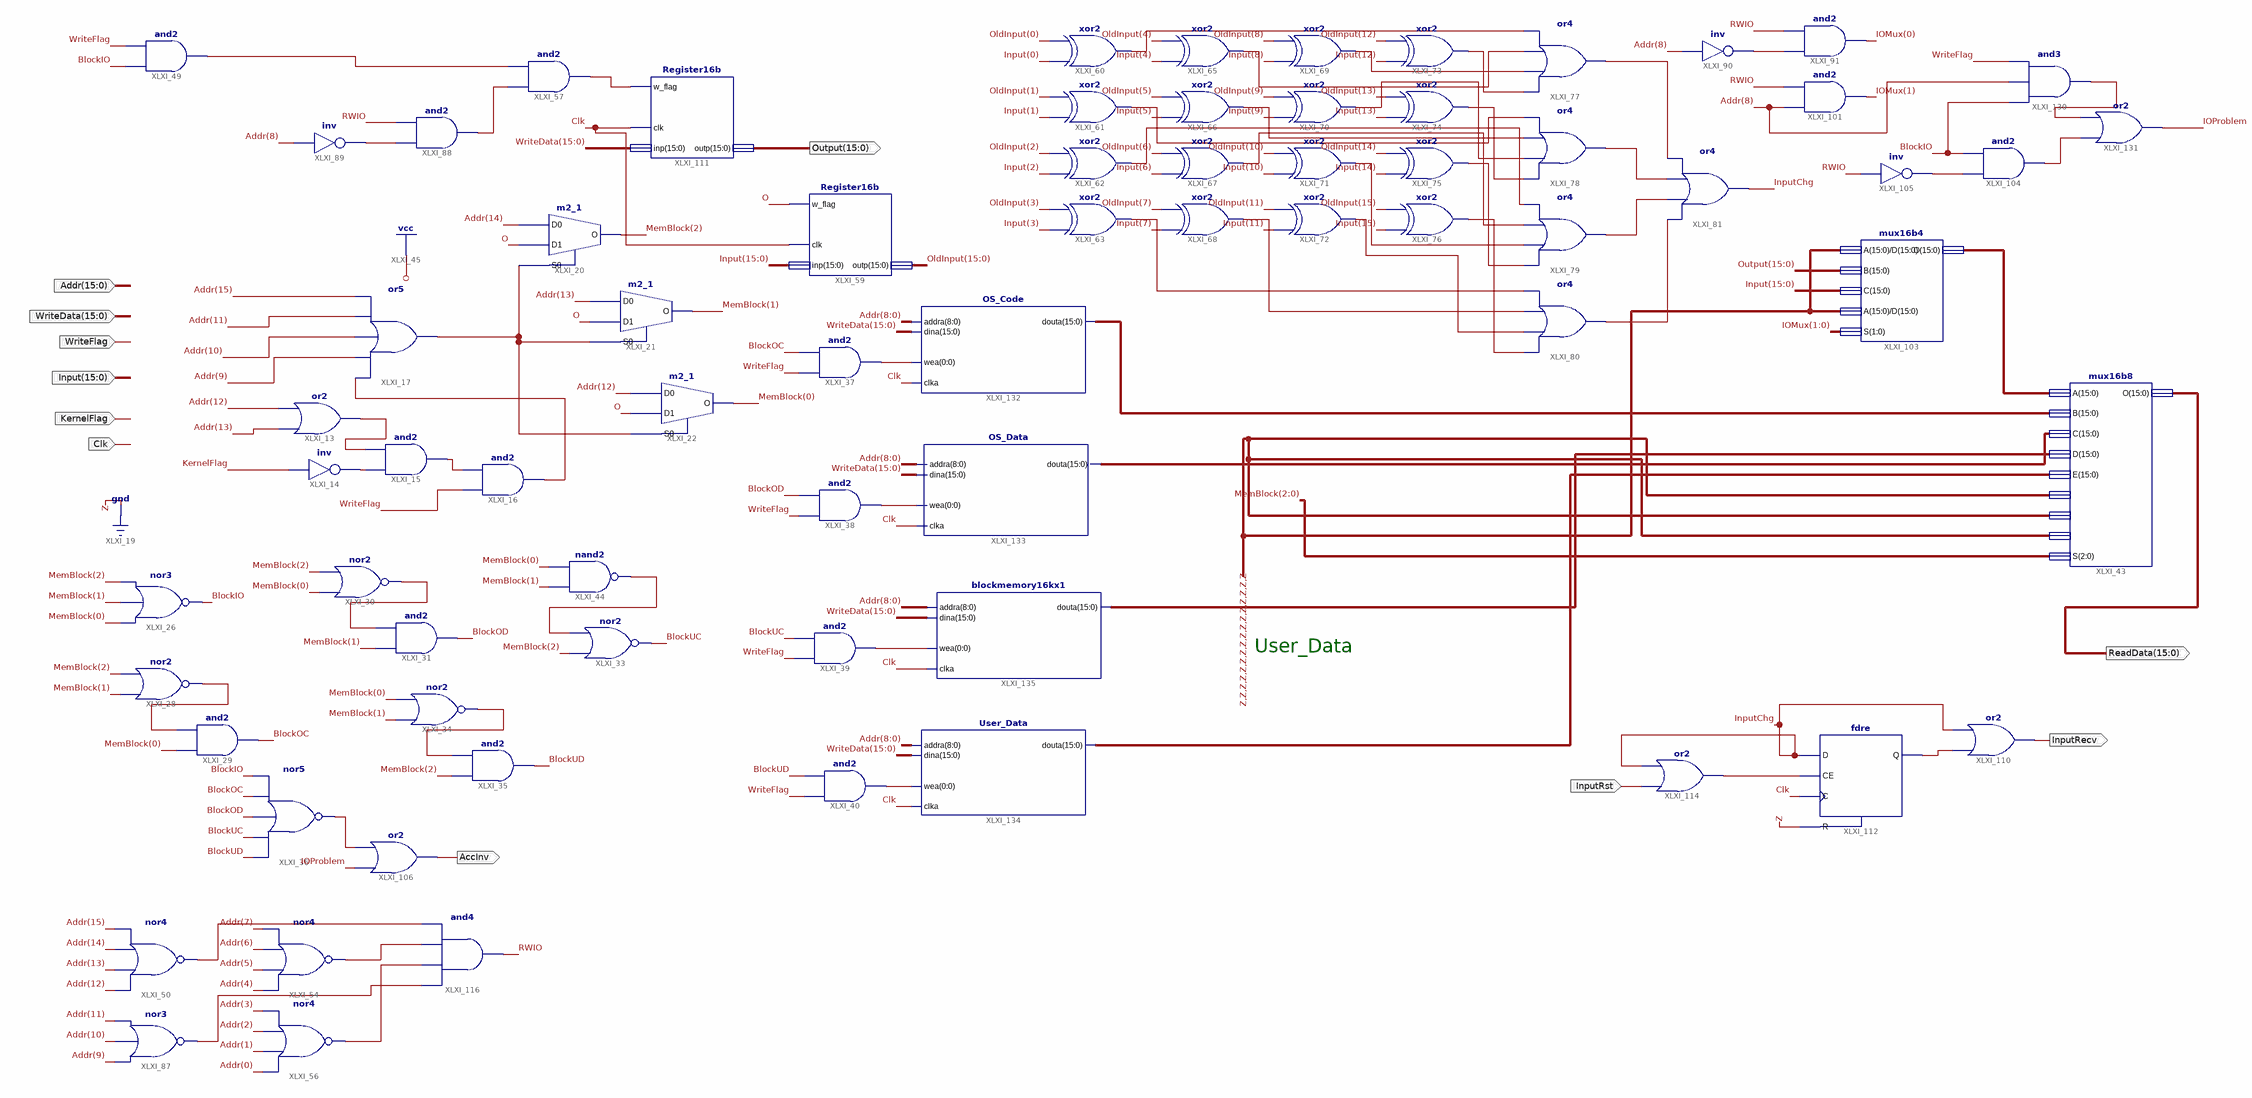
[diagram p0: schematic sheet 1]
// Xilinx ISE schematic Memory.sch (artix7) as structural Verilog: 71 symbols, 11 ports
module Memory (
  input  [15:0] Addr,
  input  [15:0] WriteData,
  input  WriteFlag,
  input  [15:0] Input,
  input  KernelFlag,
  input  Clk,
  input  InputRst,
  output [15:0] Output,
  output AccInv,
  output [15:0] ReadData,
  output InputRecv
);

  wire BlockIO, BlockOC, BlockOD, BlockUC, BlockUD, InputChg, IOProblem, RWIO, XLXN_45, XLXN_47, XLXN_50,
       XLXN_54, XLXN_58, XLXN_63, XLXN_69, XLXN_74, XLXN_80, XLXN_124, XLXN_125, XLXN_126, XLXN_127,
       XLXN_129, XLXN_174, XLXN_175, XLXN_176, XLXN_177, XLXN_178, XLXN_179, XLXN_180, XLXN_181, XLXN_182,
       XLXN_183, XLXN_184, XLXN_185, XLXN_186, XLXN_187, XLXN_188, XLXN_189, XLXN_191, XLXN_192, XLXN_193,
       XLXN_194, XLXN_223, XLXN_226, XLXN_262, XLXN_266, XLXN_274, XLXN_283, XLXN_287, XLXN_289, XLXN_322,
       XLXN_323, Z;
  wire [0:0] XLXN_92, XLXN_93, XLXN_328, XLXN_329;
  wire [1:0] IOMux;
  wire [2:0] MemBlock;
  wire [15:0] OldInput, XLXN_96, XLXN_97, XLXN_98, XLXN_99, XLXN_260;

  or XLXI_13 (XLXN_47, Addr[13], Addr[12]);
  not XLXI_14 (XLXN_45, KernelFlag);
  and XLXI_15 (XLXN_50, XLXN_45, XLXN_47);
  and XLXI_16 (XLXN_54, WriteFlag, XLXN_50);
  or XLXI_17 (XLXN_58, XLXN_54, Addr[9], Addr[10], Addr[11], Addr[15]);
  m2_1 XLXI_20 (.D0(Addr[14]), .D1(1'b1), .S0(XLXN_58), .O(MemBlock[2]));
  m2_1 XLXI_21 (.D0(Addr[13]), .D1(1'b1), .S0(XLXN_58), .O(MemBlock[1]));
  m2_1 XLXI_22 (.D0(Addr[12]), .D1(1'b1), .S0(XLXN_58), .O(MemBlock[0]));
  nor XLXI_26 (BlockIO, MemBlock[0], MemBlock[1], MemBlock[2]);
  nor XLXI_28 (XLXN_63, MemBlock[1], MemBlock[2]);
  and XLXI_29 (BlockOC, MemBlock[0], XLXN_63);
  nor XLXI_30 (XLXN_69, MemBlock[0], MemBlock[2]);
  and XLXI_31 (BlockOD, MemBlock[1], XLXN_69);
  nor XLXI_33 (BlockUC, MemBlock[2], XLXN_74);
  nor XLXI_34 (XLXN_80, MemBlock[1], MemBlock[0]);
  and XLXI_35 (BlockUD, MemBlock[2], XLXN_80);
  nor XLXI_36 (XLXN_266, BlockUD, BlockUC, BlockOD, BlockOC, BlockIO);
  and XLXI_37 (XLXN_328[0], WriteFlag, BlockOC);
  and XLXI_38 (XLXN_329[0], WriteFlag, BlockOD);
  and XLXI_39 (XLXN_92[0], WriteFlag, BlockUC);
  and XLXI_40 (XLXN_93[0], WriteFlag, BlockUD);
  mux16b8 XLXI_43 (
    .A(XLXN_260), .B(XLXN_96), .C(XLXN_97), .D(XLXN_98), .E(XLXN_99), .F({16{Z}}), .G({16{Z}}), .H({16{Z}}),
    .S(MemBlock), .O(ReadData));
  nand XLXI_44 (XLXN_74, MemBlock[1], MemBlock[0]);
  and XLXI_49 (XLXN_289, BlockIO, WriteFlag);
  and XLXI_57 (XLXN_287, XLXN_129, XLXN_289);
  Register16b XLXI_59 (.w_flag(1'b1), .clk(Clk), .inp(Input), .outp(OldInput));
  xor XLXI_60 (XLXN_174, Input[0], OldInput[0]);
  xor XLXI_61 (XLXN_178, Input[1], OldInput[1]);
  xor XLXI_62 (XLXN_182, Input[2], OldInput[2]);
  xor XLXI_63 (XLXN_186, Input[3], OldInput[3]);
  xor XLXI_65 (XLXN_175, Input[4], OldInput[4]);
  xor XLXI_66 (XLXN_179, Input[5], OldInput[5]);
  xor XLXI_67 (XLXN_183, Input[6], OldInput[6]);
  xor XLXI_68 (XLXN_187, Input[7], OldInput[7]);
  xor XLXI_69 (XLXN_176, Input[8], OldInput[8]);
  xor XLXI_70 (XLXN_180, Input[9], OldInput[9]);
  xor XLXI_71 (XLXN_184, Input[10], OldInput[10]);
  xor XLXI_72 (XLXN_188, Input[11], OldInput[11]);
  xor XLXI_73 (XLXN_177, Input[12], OldInput[12]);
  xor XLXI_74 (XLXN_181, Input[13], OldInput[13]);
  xor XLXI_75 (XLXN_185, Input[14], OldInput[14]);
  xor XLXI_76 (XLXN_189, Input[15], OldInput[15]);
  or XLXI_77 (XLXN_191, XLXN_177, XLXN_176, XLXN_175, XLXN_174);
  or XLXI_78 (XLXN_192, XLXN_181, XLXN_180, XLXN_179, XLXN_178);
  or XLXI_79 (XLXN_193, XLXN_185, XLXN_184, XLXN_183, XLXN_182);
  or XLXI_80 (XLXN_194, XLXN_189, XLXN_188, XLXN_187, XLXN_186);
  or XLXI_81 (InputChg, XLXN_194, XLXN_193, XLXN_192, XLXN_191);
  nor XLXI_50 (XLXN_124, Addr[12], Addr[13], Addr[14], Addr[15]);
  nor XLXI_54 (XLXN_127, Addr[4], Addr[5], Addr[6], Addr[7]);
  nor XLXI_56 (XLXN_126, Addr[0], Addr[1], Addr[2], Addr[3]);
  nor XLXI_87 (XLXN_125, Addr[9], Addr[10], Addr[11]);
  and XLXI_88 (XLXN_129, XLXN_223, RWIO);
  not XLXI_89 (XLXN_223, Addr[8]);
  mux16b4 XLXI_103 (.A({16{Z}}), .B(Output), .C(Input), .D({16{Z}}), .S(IOMux), .O(XLXN_260));
  or XLXI_106 (AccInv, IOProblem, XLXN_266);
  or XLXI_110 (InputRecv, XLXN_274, InputChg);
  Register16b XLXI_111 (.w_flag(XLXN_287), .clk(Clk), .inp(WriteData), .outp(Output));
  fdre XLXI_112 (.C(Clk), .CE(XLXN_283), .D(InputChg), .R(Z), .Q(XLXN_274));
  or XLXI_114 (XLXN_283, InputRst, InputChg);
  and XLXI_116 (RWIO, XLXN_125, XLXN_126, XLXN_127, XLXN_124);
  and XLXI_91 (IOMux[0], XLXN_226, RWIO);
  not XLXI_90 (XLXN_226, Addr[8]);
  and XLXI_101 (IOMux[1], Addr[8], RWIO);
  and XLXI_104 (XLXN_323, XLXN_262, BlockIO);
  not XLXI_105 (XLXN_262, RWIO);
  and XLXI_130 (XLXN_322, BlockIO, Addr[8], WriteFlag);
  or XLXI_131 (IOProblem, XLXN_323, XLXN_322);
  OS_Code XLXI_132 (.addra(Addr[8:0]), .dina(WriteData), .wea(XLXN_328[0]), .clka(Clk), .douta(XLXN_96));
  OS_Data XLXI_133 (.addra(Addr[8:0]), .dina(WriteData), .wea(XLXN_329[0]), .clka(Clk), .douta(XLXN_97));
  User_Data XLXI_134 (.addra(Addr[8:0]), .dina(WriteData), .wea(XLXN_93[0]), .clka(Clk), .douta(XLXN_99));
  blockmemory16kx1 XLXI_135 (.addra(Addr[8:0]), .dina(WriteData), .wea(XLXN_92[0]), .clka(Clk), .douta(XLXN_98));
  // also tied to GND on the sheet: Z

  // Notes on the sheet:
  //   User_Data
endmodule
